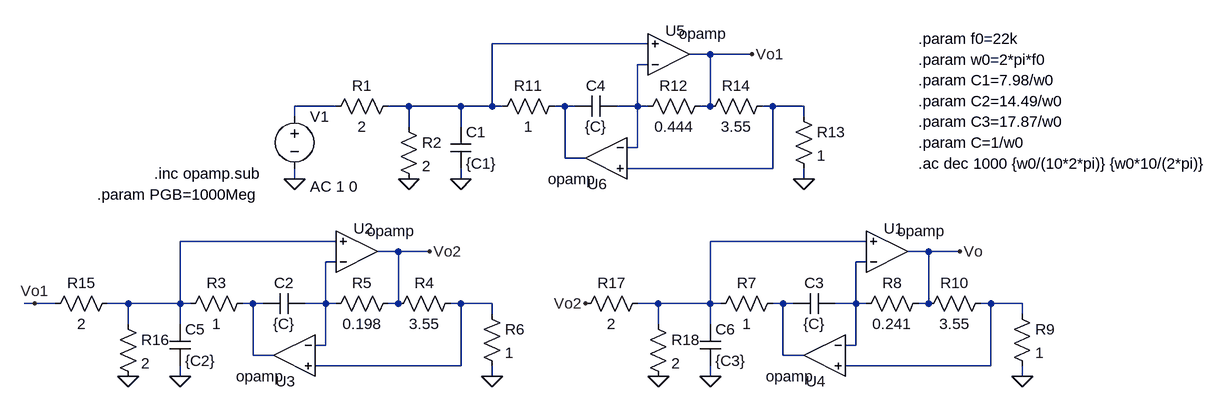
[diagram p0: schematic Cheby_BP_Orden6_Activado.asc]
Cheby_BP_Orden6_Activado.asc, the LTspice schematic file:
Version 4
SHEET 1 1652 680
WIRE 688 0 448 0
WIRE 784 16 752 16
WIRE 848 16 784 16
WIRE 688 32 672 32
WIRE 208 96 144 96
WIRE 320 96 288 96
WIRE 400 96 320 96
WIRE 448 96 448 0
WIRE 448 96 400 96
WIRE 464 96 448 96
WIRE 560 96 544 96
WIRE 576 96 560 96
WIRE 672 96 672 32
WIRE 672 96 640 96
WIRE 688 96 672 96
WIRE 784 96 784 16
WIRE 784 96 768 96
WIRE 880 96 864 96
WIRE 928 96 880 96
WIRE 144 112 144 96
WIRE 928 112 928 96
WIRE 320 128 320 96
WIRE 400 128 400 96
WIRE 672 160 672 96
WIRE 672 160 656 160
WIRE 560 176 560 96
WIRE 592 176 560 176
WIRE 880 192 880 96
WIRE 880 192 656 192
WIRE 144 208 144 192
WIRE 400 208 400 192
WIRE 928 208 928 192
WIRE 208 304 -32 304
WIRE 1024 304 784 304
WIRE 304 320 272 320
WIRE 352 320 304 320
WIRE 1120 320 1088 320
WIRE 1168 320 1120 320
WIRE 208 336 192 336
WIRE 1024 336 1008 336
WIRE -256 400 -272 400
WIRE -224 400 -256 400
WIRE -112 400 -144 400
WIRE -32 400 -32 304
WIRE -32 400 -112 400
WIRE -16 400 -32 400
WIRE 80 400 64 400
WIRE 96 400 80 400
WIRE 192 400 192 336
WIRE 192 400 160 400
WIRE 208 400 192 400
WIRE 304 400 304 320
WIRE 304 400 288 400
WIRE 400 400 384 400
WIRE 448 400 400 400
WIRE 704 400 672 400
WIRE 784 400 784 304
WIRE 784 400 704 400
WIRE 800 400 784 400
WIRE 896 400 880 400
WIRE 912 400 896 400
WIRE 1008 400 1008 336
WIRE 1008 400 976 400
WIRE 1024 400 1008 400
WIRE 1120 400 1120 320
WIRE 1120 400 1104 400
WIRE 1216 400 1200 400
WIRE 1264 400 1216 400
WIRE 448 416 448 400
WIRE 1264 416 1264 400
WIRE -112 432 -112 400
WIRE -32 432 -32 400
WIRE 704 432 704 400
WIRE 784 432 784 400
WIRE 192 464 192 400
WIRE 192 464 176 464
WIRE 1008 464 1008 400
WIRE 1008 464 992 464
WIRE 80 480 80 400
WIRE 112 480 80 480
WIRE 896 480 896 400
WIRE 928 480 896 480
WIRE 400 496 400 400
WIRE 400 496 176 496
WIRE 1216 496 1216 400
WIRE 1216 496 992 496
WIRE -32 512 -32 496
WIRE 448 512 448 496
WIRE 784 512 784 496
WIRE 1264 512 1264 496
FLAG 144 208 0
FLAG 448 512 0
FLAG 1264 512 0
FLAG 928 208 0
FLAG 320 208 0
FLAG 400 208 0
FLAG 848 16 Vo1
FLAG -112 512 0
FLAG -32 512 0
FLAG 704 512 0
FLAG 784 512 0
FLAG -256 400 Vo1
FLAG 352 320 Vo2
FLAG 592 400 Vo2
FLAG 1168 320 Vo
SYMBOL res 304 80 R90
WINDOW 0 0 56 VBottom 2
WINDOW 3 32 56 VTop 2
SYMATTR InstName R1
SYMATTR Value 2
SYMBOL voltage 144 96 R0
WINDOW 123 24 124 Left 2
WINDOW 39 0 0 Left 0
SYMATTR Value2 AC 1 0
SYMATTR InstName V1
SYMATTR Value ""
SYMBOL Opamps\\opamp 240 384 M180
WINDOW 0 -5 100 Left 2
SYMATTR InstName U2
SYMATTR SpiceLine2 GBW={PGB}
SYMBOL Opamps\\opamp 144 416 M0
WINDOW 0 -2 104 Left 2
SYMATTR InstName U3
SYMATTR SpiceLine2 GBW={PGB}
SYMBOL res 80 384 R90
WINDOW 0 0 56 VBottom 2
WINDOW 3 32 56 VTop 2
SYMATTR InstName R3
SYMATTR Value 1
SYMBOL res 304 384 R90
WINDOW 0 0 56 VBottom 2
WINDOW 3 32 56 VTop 2
SYMATTR InstName R5
SYMATTR Value 0.198
SYMBOL res 432 400 R0
SYMATTR InstName R6
SYMATTR Value 1
SYMBOL res 304 112 R0
SYMATTR InstName R2
SYMATTR Value 2
SYMBOL cap 384 128 R0
SYMATTR InstName C1
SYMATTR Value {C1}
SYMBOL cap 160 384 R90
WINDOW 0 0 32 VBottom 2
WINDOW 3 32 32 VTop 2
SYMATTR InstName C2
SYMATTR Value {C}
SYMBOL res 400 384 R90
WINDOW 0 0 56 VBottom 2
WINDOW 3 32 56 VTop 2
SYMATTR InstName R4
SYMATTR Value 3.55
SYMBOL Opamps\\opamp 1056 384 M180
WINDOW 0 -5 100 Left 2
SYMATTR InstName U1
SYMATTR SpiceLine2 GBW={PGB}
SYMBOL Opamps\\opamp 960 416 M0
WINDOW 0 -2 104 Left 2
SYMATTR InstName U4
SYMATTR SpiceLine2 GBW={PGB}
SYMBOL res 896 384 R90
WINDOW 0 0 56 VBottom 2
WINDOW 3 32 56 VTop 2
SYMATTR InstName R7
SYMATTR Value 1
SYMBOL res 1120 384 R90
WINDOW 0 0 56 VBottom 2
WINDOW 3 32 56 VTop 2
SYMATTR InstName R8
SYMATTR Value 0.241
SYMBOL res 1248 400 R0
SYMATTR InstName R9
SYMATTR Value 1
SYMBOL cap 976 384 R90
WINDOW 0 0 32 VBottom 2
WINDOW 3 32 32 VTop 2
SYMATTR InstName C3
SYMATTR Value {C}
SYMBOL res 1216 384 R90
WINDOW 0 0 56 VBottom 2
WINDOW 3 32 56 VTop 2
SYMATTR InstName R10
SYMATTR Value 3.55
SYMBOL Opamps\\opamp 720 80 M180
WINDOW 0 -5 100 Left 2
SYMATTR InstName U5
SYMBOL Opamps\\opamp 624 112 M0
WINDOW 0 -2 104 Left 2
SYMATTR InstName U6
SYMATTR SpiceLine2 GBW={PGB}
SYMBOL res 560 80 R90
WINDOW 0 0 56 VBottom 2
WINDOW 3 32 56 VTop 2
SYMATTR InstName R11
SYMATTR Value 1
SYMBOL res 784 80 R90
WINDOW 0 0 56 VBottom 2
WINDOW 3 32 56 VTop 2
SYMATTR InstName R12
SYMATTR Value 0.444
SYMBOL res 912 96 R0
SYMATTR InstName R13
SYMATTR Value 1
SYMBOL cap 640 80 R90
WINDOW 0 0 32 VBottom 2
WINDOW 3 32 32 VTop 2
SYMATTR InstName C4
SYMATTR Value {C}
SYMBOL res 880 80 R90
WINDOW 0 0 56 VBottom 2
WINDOW 3 32 56 VTop 2
SYMATTR InstName R14
SYMATTR Value 3.55
SYMBOL res -128 384 R90
WINDOW 0 0 56 VBottom 2
WINDOW 3 32 56 VTop 2
SYMATTR InstName R15
SYMATTR Value 2
SYMBOL res -128 416 R0
SYMATTR InstName R16
SYMATTR Value 2
SYMBOL cap -48 432 R0
SYMATTR InstName C5
SYMATTR Value {C2}
SYMBOL res 688 384 R90
WINDOW 0 0 56 VBottom 2
WINDOW 3 32 56 VTop 2
SYMATTR InstName R17
SYMATTR Value 2
SYMBOL res 688 416 R0
SYMATTR InstName R18
SYMATTR Value 2
SYMBOL cap 768 432 R0
SYMATTR InstName C6
SYMATTR Value {C3}
TEXT -72 200 Left 2 !.inc opamp.sub
TEXT 1104 184 Left 2 !.ac dec 1000 {w0/(10*2*pi)} {w0*10/(2*pi)}
TEXT 1104 56 Left 2 !.param C1=7.98/w0
TEXT 1104 88 Left 2 !.param C2=14.49/w0
TEXT 1104 120 Left 2 !.param C3=17.87/w0
TEXT 1104 152 Left 2 !.param C=1/w0
TEXT 1104 24 Left 2 !.param w0=2*pi*f0
TEXT 1104 -8 Left 2 !.param f0=22k
TEXT -160 232 Left 2 !.param PGB=1000Meg

The netlist it stands for:
* Cheby_BP_Orden6_Activado.asc
R1 N001 N003 2
V1 N003 0 AC 1 0
XU2 N008 N006 Vo2 opamp Aol=100K GBW={PGB}  ; pins invin noninvin out
XU3 N008 N011 N010 opamp Aol=100K GBW={PGB}  ; pins invin noninvin out
R3 N010 N006 1
R5 Vo2 N008 0.198
R6 N011 0 1
R2 N001 0 2
C1 N001 0 {C1}
C2 N008 N010 {C}
R4 N011 Vo2 3.55
XU1 N009 N007 Vo opamp Aol=100K GBW={PGB}  ; pins invin noninvin out
XU4 N009 N013 N012 opamp Aol=100K GBW={PGB}  ; pins invin noninvin out
R7 N012 N007 1
R8 Vo N009 0.241
R9 N013 0 1
C3 N009 N012 {C}
R10 N013 Vo 3.55
XU5 N002 N001 Vo1 opamp Aol=100K GBW=10Meg  ; pins invin noninvin out
XU6 N002 N005 N004 opamp Aol=100K GBW={PGB}  ; pins invin noninvin out
R11 N004 N001 1
R12 Vo1 N002 0.444
R13 N005 0 1
C4 N002 N004 {C}
R14 N005 Vo1 3.55
R15 N006 Vo1 2
R16 N006 0 2
C5 N006 0 {C2}
R17 N007 Vo2 2
R18 N007 0 2
C6 N007 0 {C3}
.inc opamp.sub
.ac dec 1000 {w0/(10*2*pi)} {w0*10/(2*pi)}
.param C1=7.98/w0
.param C2=14.49/w0
.param C3=17.87/w0
.param C=1/w0
.param w0=2*pi*f0
.param f0=22k
.param PGB=1000Meg
.backanno
.end